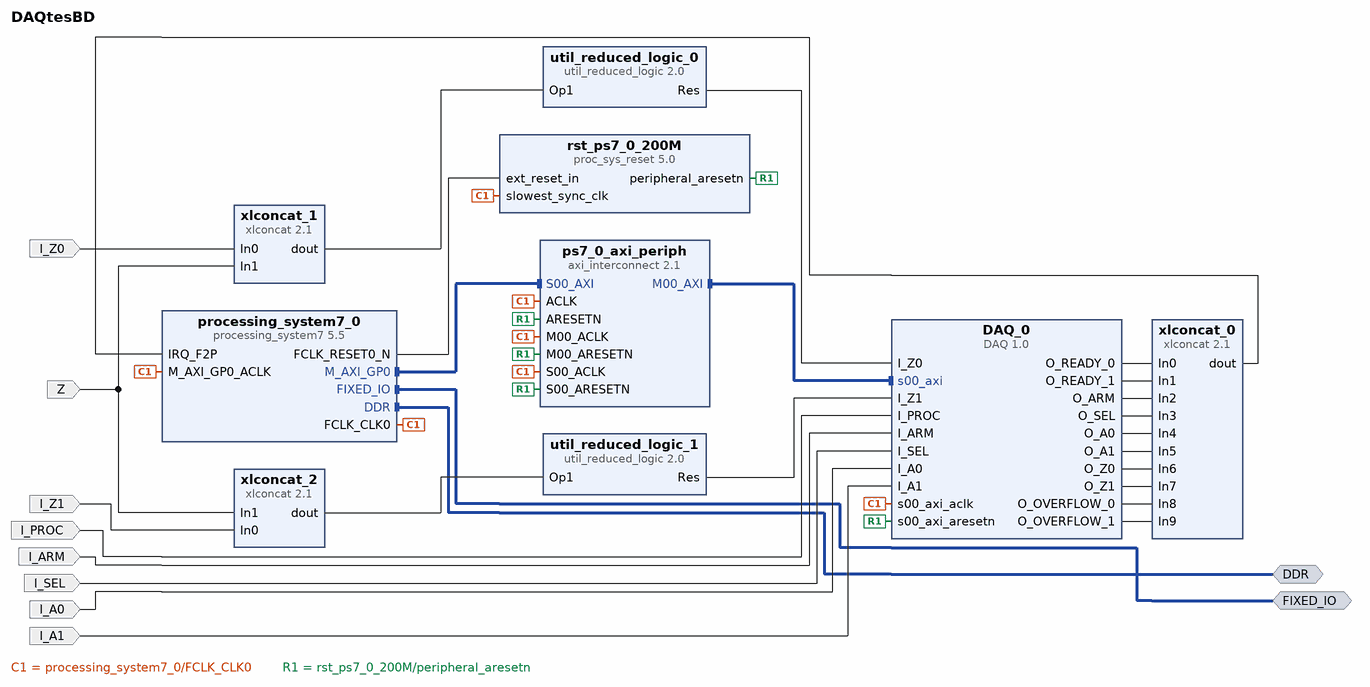
[diagram p0: block diagram of the top level]
# Vivado block design DAQtesBD, xc7z020clg400-1, Vivado 2020.1
create_bd_design DAQtesBD

create_bd_intf_port -mode Master -vlnv xilinx.com:interface:ddrx_rtl:1.0 DDR
create_bd_intf_port -mode Master -vlnv xilinx.com:display_processing_system7:fixedio_rtl:1.0 FIXED_IO
create_bd_port -dir I I_PROC
create_bd_port -dir I I_ARM
create_bd_port -dir I I_SEL
create_bd_port -dir I I_A0
create_bd_port -dir I I_A1
create_bd_port -dir I I_Z0
create_bd_port -dir I I_Z1
create_bd_port -dir I Z

create_bd_cell -type ip -vlnv xilinx.com:ip:processing_system7:5.5 processing_system7_0
set_property -dict [list \
  CONFIG.PCW_APU_PERIPHERAL_FREQMHZ 667 \
  CONFIG.PCW_ENET0_ENET0_IO {MIO 16 .. 27} \
  CONFIG.PCW_ENET0_GRP_MDIO_ENABLE 1 \
  CONFIG.PCW_ENET0_GRP_MDIO_IO {MIO 52 .. 53} \
  CONFIG.PCW_ENET0_PERIPHERAL_ENABLE 1 \
  CONFIG.PCW_ENET0_RESET_ENABLE 0 \
  CONFIG.PCW_ENET_RESET_ENABLE 1 \
  CONFIG.PCW_ENET_RESET_SELECT {Share reset pin} \
  CONFIG.PCW_FPGA0_PERIPHERAL_FREQMHZ 200 \
  CONFIG.PCW_GPIO_MIO_GPIO_ENABLE 1 \
  CONFIG.PCW_GPIO_MIO_GPIO_IO MIO \
  CONFIG.PCW_I2C_RESET_ENABLE 1 \
  CONFIG.PCW_IRQ_F2P_INTR 1 \
  CONFIG.PCW_PRESET_BANK1_VOLTAGE {LVCMOS 1.8V} \
  CONFIG.PCW_QSPI_GRP_FBCLK_ENABLE 1 \
  CONFIG.PCW_QSPI_GRP_FBCLK_IO {MIO 8} \
  CONFIG.PCW_QSPI_GRP_SINGLE_SS_ENABLE 1 \
  CONFIG.PCW_QSPI_GRP_SINGLE_SS_IO {MIO 1 .. 6} \
  CONFIG.PCW_QSPI_PERIPHERAL_ENABLE 1 \
  CONFIG.PCW_QSPI_QSPI_IO {MIO 1 .. 6} \
  CONFIG.PCW_SD0_GRP_CD_ENABLE 1 \
  CONFIG.PCW_SD0_GRP_CD_IO {MIO 47} \
  CONFIG.PCW_SD0_GRP_WP_ENABLE 0 \
  CONFIG.PCW_SD0_PERIPHERAL_ENABLE 1 \
  CONFIG.PCW_SD0_SD0_IO {MIO 40 .. 45} \
  CONFIG.PCW_SDIO_PERIPHERAL_FREQMHZ 50 \
  CONFIG.PCW_SINGLE_QSPI_DATA_MODE x4 \
  CONFIG.PCW_UART1_PERIPHERAL_ENABLE 1 \
  CONFIG.PCW_UART1_UART1_IO {MIO 48 .. 49} \
  CONFIG.PCW_UART_PERIPHERAL_FREQMHZ 100 \
  CONFIG.PCW_UIPARAM_DDR_FREQ_MHZ 533.333333 \
  CONFIG.PCW_UIPARAM_DDR_MEMORY_TYPE {DDR 3 (Low Voltage)} \
  CONFIG.PCW_UIPARAM_DDR_PARTNO {MT41K256M16 RE-125} \
  CONFIG.PCW_USB0_PERIPHERAL_ENABLE 1 \
  CONFIG.PCW_USB0_RESET_ENABLE 1 \
  CONFIG.PCW_USB0_RESET_IO {MIO 46} \
  CONFIG.PCW_USB0_USB0_IO {MIO 28 .. 39} \
  CONFIG.PCW_USB_RESET_ENABLE 1 \
  CONFIG.PCW_USB_RESET_SELECT {Share reset pin} \
  CONFIG.PCW_USE_FABRIC_INTERRUPT 1 \
] [get_bd_cells processing_system7_0]
# 296 more settings of processing_system7_0 are not shown: defaults, MIO pin electricals, DDR timing, and values the tool derives
create_bd_cell -type ip -vlnv user.org:user:DAQ:1.0 DAQ_0
create_bd_cell -type ip -vlnv xilinx.com:ip:axi_interconnect:2.1 ps7_0_axi_periph
set_property -dict {CONFIG.NUM_MI 1} [get_bd_cells ps7_0_axi_periph]
create_bd_cell -type ip -vlnv xilinx.com:ip:proc_sys_reset:5.0 rst_ps7_0_200M
create_bd_cell -type ip -vlnv xilinx.com:ip:xlconcat:2.1 xlconcat_0
set_property -dict {CONFIG.NUM_PORTS 10} [get_bd_cells xlconcat_0]
create_bd_cell -type ip -vlnv xilinx.com:ip:util_reduced_logic:2.0 util_reduced_logic_0
set_property -dict {CONFIG.C_OPERATION or CONFIG.C_SIZE 2} [get_bd_cells util_reduced_logic_0]
create_bd_cell -type ip -vlnv xilinx.com:ip:util_reduced_logic:2.0 util_reduced_logic_1
set_property -dict {CONFIG.C_OPERATION or CONFIG.C_SIZE 2} [get_bd_cells util_reduced_logic_1]
create_bd_cell -type ip -vlnv xilinx.com:ip:xlconcat:2.1 xlconcat_1
create_bd_cell -type ip -vlnv xilinx.com:ip:xlconcat:2.1 xlconcat_2

# ---- connections ----

connect_bd_intf_net [get_bd_intf_pins ps7_0_axi_periph/M00_AXI] [get_bd_intf_pins DAQ_0/s00_axi]
connect_bd_intf_net [get_bd_intf_ports FIXED_IO] [get_bd_intf_pins processing_system7_0/FIXED_IO]
connect_bd_intf_net [get_bd_intf_ports DDR] [get_bd_intf_pins processing_system7_0/DDR]
connect_bd_intf_net [get_bd_intf_pins processing_system7_0/M_AXI_GP0] [get_bd_intf_pins ps7_0_axi_periph/S00_AXI]
connect_bd_net [get_bd_pins processing_system7_0/FCLK_CLK0] \
  [get_bd_pins processing_system7_0/M_AXI_GP0_ACLK] [get_bd_pins ps7_0_axi_periph/S00_ACLK] \
  [get_bd_pins rst_ps7_0_200M/slowest_sync_clk] [get_bd_pins DAQ_0/s00_axi_aclk] [get_bd_pins ps7_0_axi_periph/M00_ACLK] \
  [get_bd_pins ps7_0_axi_periph/ACLK]
connect_bd_net [get_bd_pins processing_system7_0/FCLK_RESET0_N] [get_bd_pins rst_ps7_0_200M/ext_reset_in]
connect_bd_net [get_bd_pins rst_ps7_0_200M/peripheral_aresetn] \
  [get_bd_pins ps7_0_axi_periph/S00_ARESETN] [get_bd_pins DAQ_0/s00_axi_aresetn] [get_bd_pins ps7_0_axi_periph/M00_ARESETN] \
  [get_bd_pins ps7_0_axi_periph/ARESETN]
connect_bd_net [get_bd_pins DAQ_0/O_READY_0] [get_bd_pins xlconcat_0/In0]
connect_bd_net [get_bd_pins DAQ_0/O_READY_1] [get_bd_pins xlconcat_0/In1]
connect_bd_net [get_bd_pins DAQ_0/O_ARM] [get_bd_pins xlconcat_0/In2]
connect_bd_net [get_bd_pins DAQ_0/O_SEL] [get_bd_pins xlconcat_0/In3]
connect_bd_net [get_bd_pins DAQ_0/O_A0] [get_bd_pins xlconcat_0/In4]
connect_bd_net [get_bd_pins DAQ_0/O_A1] [get_bd_pins xlconcat_0/In5]
connect_bd_net [get_bd_pins DAQ_0/O_Z0] [get_bd_pins xlconcat_0/In6]
connect_bd_net [get_bd_pins DAQ_0/O_Z1] [get_bd_pins xlconcat_0/In7]
connect_bd_net [get_bd_pins DAQ_0/O_OVERFLOW_0] [get_bd_pins xlconcat_0/In8]
connect_bd_net [get_bd_pins DAQ_0/O_OVERFLOW_1] [get_bd_pins xlconcat_0/In9]
connect_bd_net [get_bd_pins xlconcat_0/dout] [get_bd_pins processing_system7_0/IRQ_F2P]
connect_bd_net [get_bd_ports I_PROC] [get_bd_pins DAQ_0/I_PROC]
connect_bd_net [get_bd_ports I_ARM] [get_bd_pins DAQ_0/I_ARM]
connect_bd_net [get_bd_ports I_SEL] [get_bd_pins DAQ_0/I_SEL]
connect_bd_net -net I_A0_1 [get_bd_ports I_A0] [get_bd_pins DAQ_0/I_A0]
connect_bd_net -net I_A1_1 [get_bd_ports I_A1] [get_bd_pins DAQ_0/I_A1]
connect_bd_net [get_bd_pins util_reduced_logic_0/Res] [get_bd_pins DAQ_0/I_Z0]
connect_bd_net [get_bd_pins util_reduced_logic_1/Res] [get_bd_pins DAQ_0/I_Z1]
connect_bd_net [get_bd_pins xlconcat_2/dout] [get_bd_pins util_reduced_logic_1/Op1]
connect_bd_net [get_bd_pins xlconcat_1/dout] [get_bd_pins util_reduced_logic_0/Op1]
connect_bd_net -net I_Z0_1 [get_bd_ports I_Z0] [get_bd_pins xlconcat_1/In0]
connect_bd_net -net I_Z1_1 [get_bd_ports I_Z1] [get_bd_pins xlconcat_2/In0]
connect_bd_net [get_bd_ports Z] [get_bd_pins xlconcat_1/In1] [get_bd_pins xlconcat_2/In1]

# ---- address map ----
assign_bd_address -offset 0x43C00000 -range 64K -target_address_space [get_bd_addr_spaces processing_system7_0/Data] [get_bd_addr_segs DAQ_0/s00_axi/reg0]

validate_bd_design
save_bd_design
